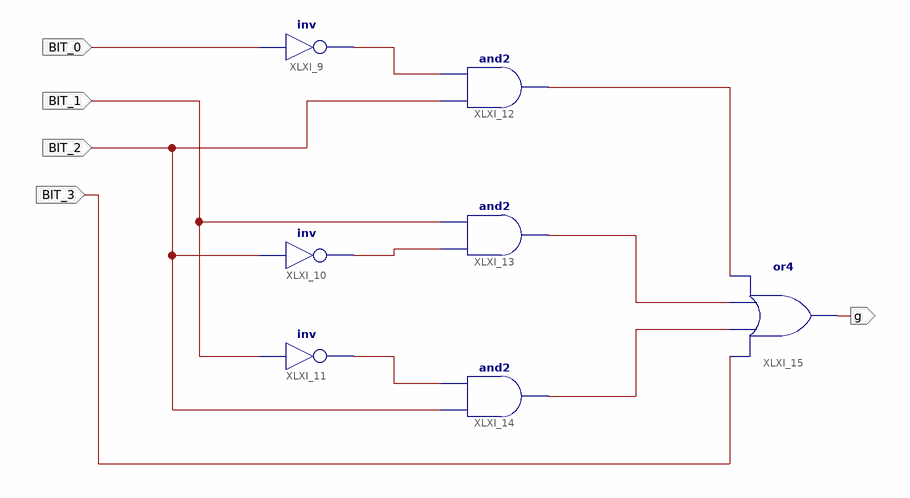
[diagram p0: schematic sheet 1]
// Xilinx ISE schematic SEG_G.sch (spartan6) as structural Verilog: 7 symbols, 5 ports
module SEG_G (
  input  BIT_0,
  input  BIT_1,
  input  BIT_2,
  input  BIT_3,
  output g
);

  wire XLXN_26, XLXN_27, XLXN_28, XLXN_29, XLXN_31, XLXN_33;

  not XLXI_9 (XLXN_26, BIT_0);
  not XLXI_10 (XLXN_33, BIT_2);
  not XLXI_11 (XLXN_31, BIT_1);
  and XLXI_12 (XLXN_27, BIT_2, XLXN_26);
  and XLXI_13 (XLXN_28, XLXN_33, BIT_1);
  and XLXI_14 (XLXN_29, BIT_2, XLXN_31);
  or XLXI_15 (g, BIT_3, XLXN_29, XLXN_28, XLXN_27);
endmodule
